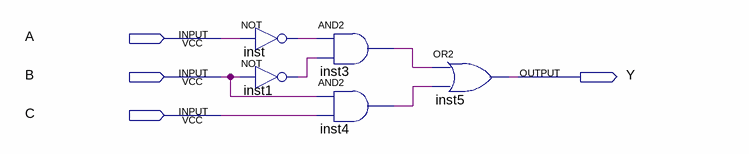
[diagram p0: schematic sheet]
// Quartus schematic Lab01_Q2.bdf as structural Verilog: 5 symbols, 4 pins
module Lab01_Q2 (
  input  A,
  input  B,
  input  C,
  output Y
);

  wire inst1_out, inst3_out, inst4_out, inst_out;

  not inst (inst_out, A);
  not inst1 (inst1_out, B);
  and inst3 (inst3_out, inst_out, inst1_out);
  and inst4 (inst4_out, B, C);
  or inst5 (Y, inst3_out, inst4_out);
endmodule
